# EAGLE schematic firing-button (EAGLE 7.2.0)
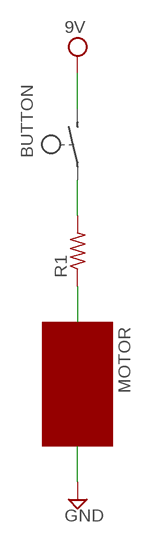
[diagram p0: schematic, sheet 1]

## Parts
R1  R-US_0204/2V  [0204V]

## Nets
N$1: R1.2
N$24: R1.1

## Notes on the sheet
- MOTOR

## Library data of the parts
R1 = rcl:R-US_: RESISTOR, American symbol